# Altium schematic sheet VT6212 Chipset.SchDoc
size A4
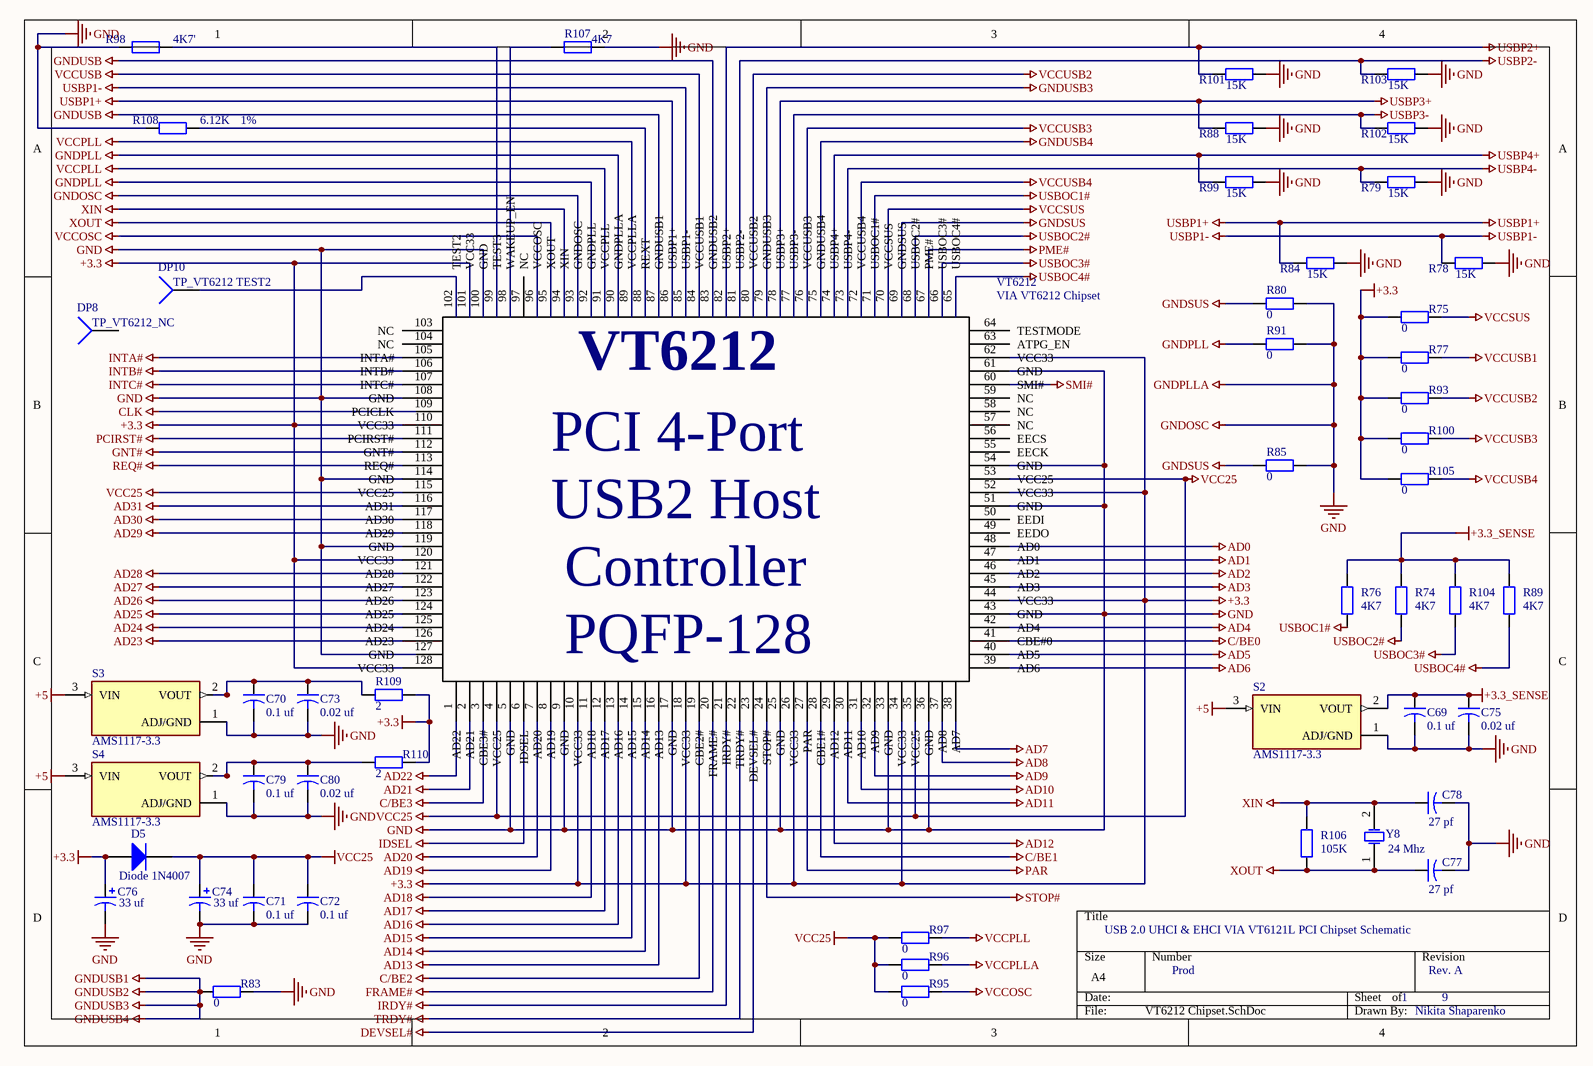
[diagram p0: VT6212 Chipset.SchDoc]

## Parts
C69  value 0.1 uf  [CAPR5-4X5]  (hidden comment: Cap2)
C70  value 0.1 uf  [CAPR5-4X5]  (hidden comment: Cap2)
C71  value 0.1 uf  [CAPR5-4X5]  (hidden comment: Cap2)
C72  value 0.1 uf  [CAPR5-4X5]  (hidden comment: Cap2)
C73  value 0.02 uf  [CAPR5-4X5]  (hidden comment: Cap2)
C74  value 33 uf  [RAD-0.2]  (hidden comment: Cap Pol1)
C75  value 0.02 uf  [CAPR5-4X5]  (hidden comment: Cap2)
C76  value 33 uf  [RAD-0.2]  (hidden comment: Cap Pol1)
C77  value 27 pf  [CAPR5-4X5]  (hidden comment: Cap2)
C78  value 27 pf  [CAPR5-4X5]  (hidden comment: Cap2)
C79  value 0.1 uf  [CAPR5-4X5]  (hidden comment: Cap2)
C80  value 0.02 uf  [CAPR5-4X5]  (hidden comment: Cap2)
D5  Diode 1N4007  [DO-41]
DP8  TP_VT6212_NC  [PIN1]
DP10  TP_VT6212 TEST2  [PIN1]
R74  value 4K7  [AXIAL-0.4]  (hidden comment: Res2)
R75  value 0  [AXIAL-0.4]  (hidden comment: Res2)
R76  value 4K7  [AXIAL-0.4]  (hidden comment: Res2)
R77  value 0  [AXIAL-0.4]  (hidden comment: Res2)
R78  value 15K  [AXIAL-0.4]  (hidden comment: Res2)
R79  value 15K  [AXIAL-0.4]  (hidden comment: Res2)
R80  value 0  [AXIAL-0.4]  (hidden comment: Res2)
R83  value 0  [AXIAL-0.4]  (hidden comment: Res2)
R84  value 15K  [AXIAL-0.4]  (hidden comment: Res2)
R85  value 0  [AXIAL-0.4]  (hidden comment: Res2)
R88  value 15K  [AXIAL-0.4]  (hidden comment: Res2)
R89  value 4K7  [AXIAL-0.4]  (hidden comment: Res2)
R91  value 0  [AXIAL-0.4]  (hidden comment: Res2)
R93  value 0  [AXIAL-0.4]  (hidden comment: Res2)
R95  value 0  [AXIAL-0.4]  (hidden comment: Res2)
R96  value 0  [AXIAL-0.4]  (hidden comment: Res2)
R97  value 0  [AXIAL-0.4]  (hidden comment: Res2)
R98  value 4K7'  [AXIAL-0.4]
R99  value 15K  [AXIAL-0.4]  (hidden comment: Res2)
R100  value 0  [AXIAL-0.4]  (hidden comment: Res2)
R101  value 15K  [AXIAL-0.4]  (hidden comment: Res2)
R102  value 15K  [AXIAL-0.4]  (hidden comment: Res2)
R103  value 15K  [AXIAL-0.4]  (hidden comment: Res2)
R104  value 4K7  [AXIAL-0.4]  (hidden comment: Res2)
R105  value 0  [AXIAL-0.4]  (hidden comment: Res2)
R106  value 105K  [AXIAL-0.4]  (hidden comment: Res2)
R107  value 4K7  [AXIAL-0.4]  (hidden comment: Res2)
R108  1%  value 6.12K  [AXIAL-0.4]
R109  value 2  [AXIAL-0.4]  (hidden comment: Res2)
R110  value 2  [AXIAL-0.4]  (hidden comment: Res2)
S2  AMS1117-3.3  [SOT229P700X180-4N]
S3  AMS1117-3.3  [SOT229P700X180-4N]
S4  AMS1117-3.3  [SOT229P700X180-4N]
VT6212  VIA VT6212 Chipset  [NXP LQFP-144 SOT486-1]
Y8  24 Mhz  [R38]

## Nets
+3.3: C76.1 D5.1(A) R75.2 R77.2 R93.2 R100.2 R105.2 R109.2 R110.1 VT6212.101(VCC33)
+3.3_SENSE: C69.1 C75.1 R74.2 R76.2 R89.2 R104.2 S2.2(VOUT)
+5: S2.3(VIN) S3.3(VIN) S4.3(VIN)
GND: C69.2 C70.2 C71.2 C72.2 C73.2 C74.2 C75.2 C76.2 C77.2 C78.2 C79.2 C80.2 R78.1 R79.1 R80.2 R83.1 R84.1 R85.2 R88.1 R91.2 R98.1 R99.1 R101.1 R102.1 R103.1 R107.1 R108.1 S2.1(ADJ/GND) S3.1(ADJ/GND) S4.1(ADJ/GND) VT6212.93(GNDOSC) VT6212.100(GND)  [also labelled GNDOSC, GNDPLLA]
GNDPLL: R91.1 VT6212.90(GNDPLLA) VT6212.92(GNDPLL)
GNDSUS: R80.1 R85.1 VT6212.69(GNDSUS)
GNDUSB: VT6212.83(GNDUSB2) VT6212.87(GNDUSB1)
GNDUSB1: R83.2 VT6212.75(GNDUSB4) VT6212.79(GNDUSB3)  [also labelled GNDUSB2, GNDUSB3, GNDUSB4]
PME#: VT6212.67(PME#)
USBOC1#: R76.1 VT6212.71(USBOC1#)
USBOC2#: R74.1 VT6212.68(USBOC2#)
USBOC3#: R104.1 VT6212.66(USBOC3#)
USBOC4#: R89.1 VT6212.65(USBOC4#)
USBP1+: R84.2 VT6212.86(USBP1+)
USBP1-: R78.2 VT6212.85(USBP1-)
USBP2+: R101.2 VT6212.82(USBP2+)
USBP2-: R103.2 VT6212.81(USBP2-)
USBP3+: R88.2 VT6212.78(USBP3+)
USBP3-: R102.2 VT6212.77(USBP3-)
USBP4+: R99.2 VT6212.74(USBP4+)
USBP4-: R79.2 VT6212.73(USBP4-)
VCC25: C71.1 C72.1 C74.1 D5.2(K) R95.2 R96.2 R97.2
VCCOSC: R95.1 VT6212.96(VCCOSC)
VCCPLL: R97.1 VT6212.89(VCCPLLA) VT6212.91(VCCPLL)
VCCPLLA: R96.1
VCCSUS: R75.1 VT6212.70(VCCSUS)
VCCUSB: VT6212.84(VCCUSB1)
VCCUSB1: R77.1
VCCUSB2: R93.1 VT6212.80(VCCUSB2)
VCCUSB3: R100.1 VT6212.76(VCCUSB3)
VCCUSB4: R105.1 VT6212.72(VCCUSB4)
XIN: C78.1 R106.2 VT6212.94(XIN) Y8.2(OSC2)
XOUT: C77.1 R106.1 VT6212.95(XOUT) Y8.1(OSC1)
NetC70_1: C70.1 C73.1 R109.1 S3.2(VOUT)
NetC79_1: C79.1 C80.1 R110.2 S4.2(VOUT)
NetDP10_1: DP10.1 VT6212.102(TEST2)
NetR98_2: R98.2 VT6212.99(TEST3)
NetR107_2: R107.2 VT6212.98(WAKEUP_EN)
NetR108_2: R108.2 VT6212.88(REXT)

Not connected (* = marked no-connect by the designer): DP8 1; VT6212 1(AD22) 2(AD21) 3(CBE3#) 4(VCC25) 5(GND) 6(IDSEL) 7(AD20) 8(AD19) 9(GND) 10(VCC33) 11(AD18) 12(AD17) 13(AD16) 14(AD15) 15(AD14) 16(AD13) 17(GND) 18(VCC33) 19(CBE2#) 20(FRAME#) 21(IRDY#) 22(TRDY#) 23(DEVSEL#) 24(STOP#) 25(GND) 26(VCC33) 27(PAR) 28(CBE1#) 29(AD12) 30(AD11) 31(AD10) 32(AD9) 33(GND) 34(VCC33) 35(VCC25) 36(GND) 37(AD8) 38(AD7) 39(AD6) 40(AD5) 41(CBE#0) 42(AD4) 43(GND) 44(VCC33) 45(AD3) 46(AD2) 47(AD1) 48(AD0) 49(EEDO) 50(EEDI) 51(GND) 52(VCC33) 53(VCC25) 54(GND) 55(EECK) 56(EECS) 57(NC) 58(NC) 59(NC) 60(SMI#) 61(GND) 62(VCC33) 63(ATPG_EN) 64(TESTMODE) 97(NC) 103(NC) 104(NC) 105(INTA#) 106(INTB#) 107(INTC#) 108(GND) 109(PCICLK) 110(VCC33) 111(PCIRST#) 112(GNT#) 113(REQ#) 114(GND) 115(VCC25) 116(AD31) 117(AD30) 118(AD29) 119(GND) 120(VCC33) 121(AD28) 122(AD27) 123(AD26) 124(AD25) 125(AD24) 126(AD23) 127(GND) 128(VCC33)

## Notes on the sheet
- USB 2.0 UHCI & EHCI VIA VT6121L PCI Chipset Schematic
- Prod
- 1
- Rev. A
- 9
- Nikita Shaparenko
- (in symbol VT6212) PCI 4-Port; USB2 Host; Controller; PQFP-128

## Library data of the parts
C69-C73 C75 C77-C80 = Cap2: Capacitor; Published: 23-Sep-2002; PackageReference: CAPR5-4X5; Publisher: Altium Limited; PackageDescription: Capacitor; 2 Leads
C74 C76 = Cap Pol1: Polarized Capacitor (Radial); Published: 8-Jun-2000; LatestRevisionDate: 17-Jul-2002; LatestRevisionNote: Re-released for DXP Platform.; PackageReference: RB7.6-15; Publisher: Altium Limited; PackageDescription: Polarized Capacitor (Radial); 2 Leads
D5 = Diode 1N4007: 1 Amp General Purpose Rectifier; Published: 8-Jun-2000; LatestRevisionDate: 17-Jul-2002; LatestRevisionNote: Re-released for DXP Platform.; DatasheetVersion: 1998; PackageVersion: Aug-1999; PackageReference: DO-41; Publisher: Altium Limited; PackageDescription: Diode, Axial; Body 5.2 x 2.7 mm (LxDia. max), Lead Dia. 0.86 mm (max); Code_JEDEC: DO-204-AL; ComponentLink1Description: Manufacturer Link; ComponentLink1URL: http://www.fairchildsemi.com/; ComponentLink2Description: Datasheet; ComponentLink2URL: http://www.fairchildsemi.com/ds/1N%2F1N4001.pdf
DP8 DP10 = Socket: LatestRevisionDate: 17-Jul-2002; LatestRevisionNote: Re-released for DXP Platform.; Publisher: Altium Limited
R74-R80 R83-R85 R88 R89 R91 R93 R95-R110 = Res2: Resistor; Published: 8-Jun-2000; LatestRevisionDate: 17-Jul-2002; LatestRevisionNote: Re-released for DXP Platform.; PackageReference: AXIAL-0.4; Publisher: Altium Limited; PackageDescription: Axial Device, Thru-Hole; 2 Leads; 0.4 in Pin Spacing
S2-S4 = AMS1117-3.3: Sot223/Pkg 1-Amp 3.3-Volt Low Drop Out Voltage Regulatator; MF: Advanced Monolithic Systems; Price: None; Package: None; Value: *; MP: AMS1117-3.3; Availability: Unavailable; SnapEDA_Link: https://www.snapeda.com/parts/AMS1117-3.3/Advanced%20Monolithic%20Systems/view-part/53450/?ref=snap
VT6212 = VT6212: VT6212 PCI 4-Port USB2 Host Controller PQFP-128
Y8 = XTAL: Crystal Oscillator; Published: 8-Jun-2000; LatestRevisionDate: 17-Jul-2002; LatestRevisionNote: Re-released for DXP Platform.; PackageReference: R38; Publisher: Altium Limited; PackageDescription: Crystal, Thru-Hole; 2 Leads; Body 3.1 x 8.2 mm (Dia.xH)